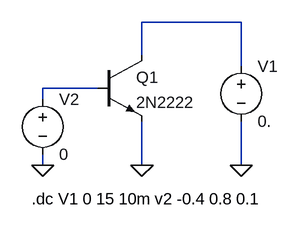
[diagram p0: schematic curva de salida tbj.asc]
curva de salida tbj.asc, the LTspice schematic file:
Version 4
SHEET 1 2612 1528
WIRE 2128 1152 1984 1152
WIRE 1984 1200 1984 1152
WIRE 2128 1216 2128 1152
WIRE 1920 1248 1840 1248
WIRE 1840 1264 1840 1248
WIRE 1840 1360 1840 1344
WIRE 1984 1360 1984 1296
WIRE 2128 1360 2128 1296
FLAG 2128 1360 0
FLAG 1984 1360 0
FLAG 1840 1360 0
SYMBOL npn 1920 1200 R0
SYMATTR InstName Q1
SYMATTR Value 2N2222
SYMBOL voltage 2128 1200 R0
SYMATTR InstName V1
SYMATTR Value 0.
SYMBOL voltage 1840 1248 R0
WINDOW 123 0 0 Left 0
WINDOW 39 0 0 Left 0
SYMATTR InstName V2
SYMATTR Value 0
TEXT 1824 1408 Left 2 !.dc V1 0 15 10m v2 -0.4 0.8 0.1

The netlist it stands for:
* curva de salida tbj.asc
Q1 N001 N002 0 0 2N2222
V1 N001 0 0.
V2 N002 0 0
.model NPN NPN
.model PNP PNP
.lib standard.bjt
.dc V1 0 15 10m v2 -0.4 0.8 0.1
.backanno
.end